# EAGLE design lorelei_B_v1_1 (EAGLE 9.6.2)

## Sheet 1 of 4: Power and decoupling
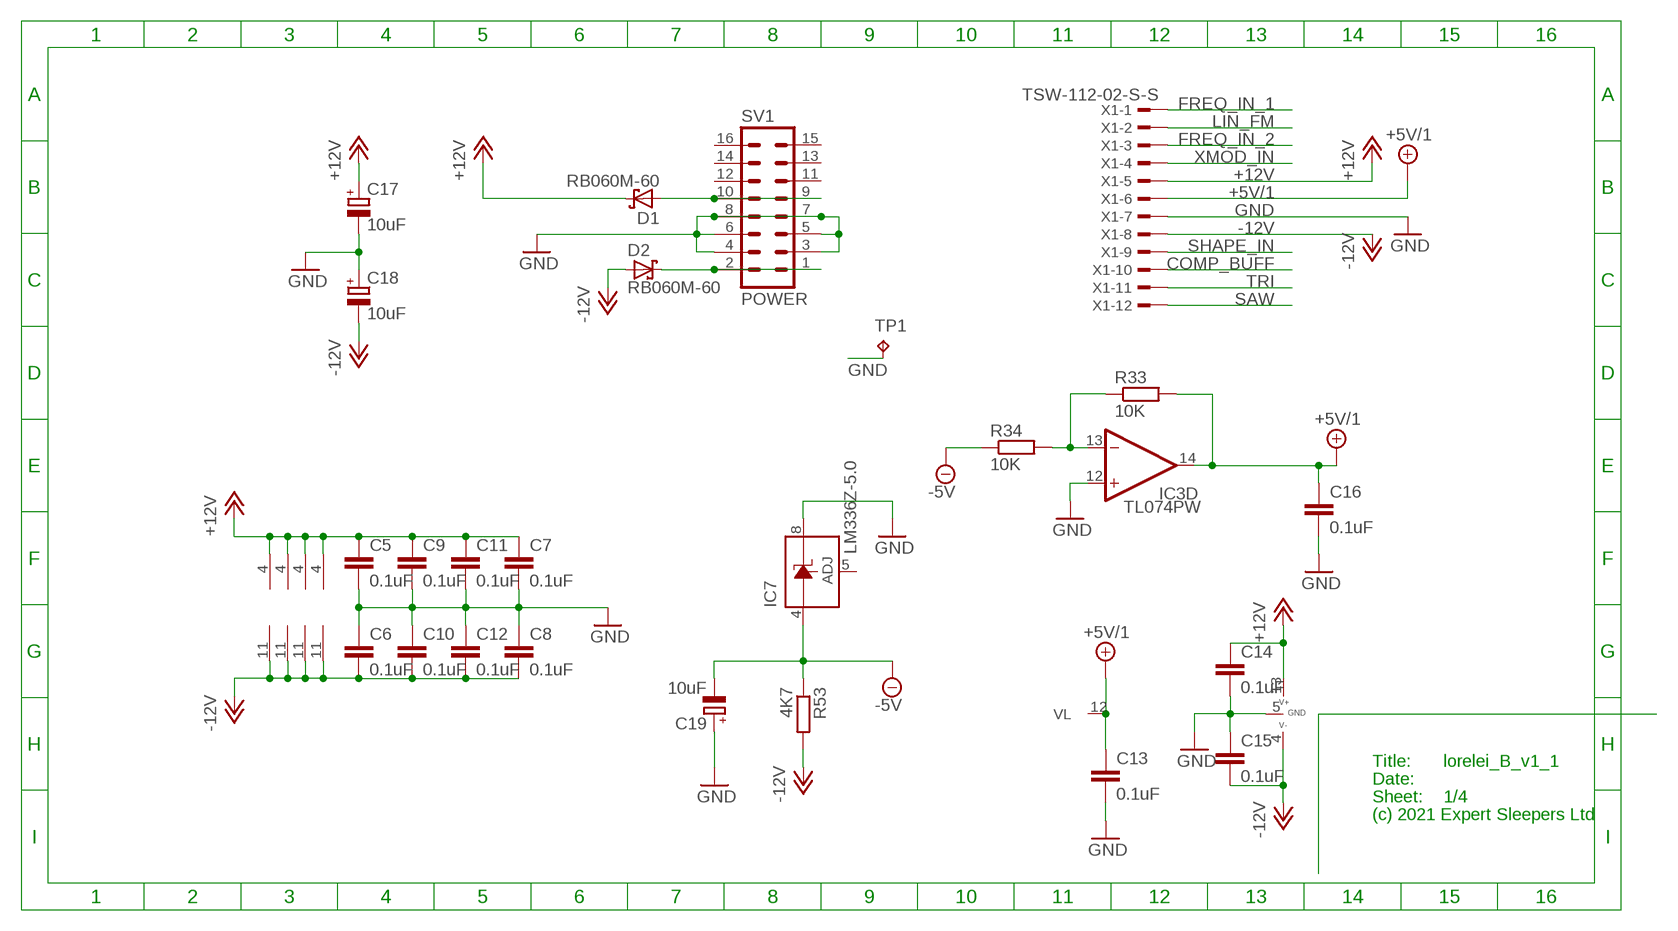
[diagram p0: schematic, sheet 1]

### Parts
C5  0.1uF  C-EUC0402  [C0402]
C6  0.1uF  C-EUC0402  [C0402]
C7  0.1uF  C-EUC0402  [C0402]
C8  0.1uF  C-EUC0402  [C0402]
C9  0.1uF  C-EUC0402  [C0402]
C10  0.1uF  C-EUC0402  [C0402]
C11  0.1uF  C-EUC0402  [C0402]
C12  0.1uF  C-EUC0402  [C0402]
C13  0.1uF  C-EUC0402  [C0402]
C14  0.1uF  C-EUC0402  [C0402]
C15  0.1uF  C-EUC0402  [C0402]
C16  0.1uF  C-EUC0402  [C0402]
C17  10uF  CPOL-EUUD-4X5,8  [UD-4X5,8_NICHICON]
C18  10uF  CPOL-EUUD-4X5,8  [UD-4X5,8_NICHICON]
C19  10uF  CPOL-EUUD-4X5,8  [UD-4X5,8_NICHICON]
D1  RB060M-60  [SOD123FL]
D2  RB060M-60  [SOD123FL]
IC1  TL074PW  [PW_R-PDSO-G14]
IC2  TL074PW  [PW_R-PDSO-G14]
IC3  TL074PW  [PW_R-PDSO-G14]
IC4  TL074PW  [PW_R-PDSO-G14]
IC7  LM336Z-5.0  LM336D  [SO08]
IC8  DG211BDY  DG211CJD  [SO16]
R33  10K  R-EU_R0603  [R0603]
R34  10K  R-EU_R0603  [R0603]
R53  4K7  R-EU_R0603  [R0603]
SV1  POWER  ML16  [ML16]
TP1  RA2  TPPAD1-13  [P1-13]
X1  TSW-112-02-S-S  [TSW-112-02-S-S]

### Nets
+5V/1: C13.1 C16.1 IC3.14(D:OUT) IC8.12(VL:VL) R33.2 X1.6 ; also sheet 4
+12V: C5.1 C7.1 C9.1 C11.1 C14.1 C17.+ D1.C IC1.4(P:V+) IC2.4(P:V+) IC3.4(P:V+) IC4.4(P:V+) IC8.13(P:V+) X1.5 ; also sheet 2,3,4
-5V: C19.- IC7.4(A) R34.1 R53.1 ; also sheet 2
-12V: C6.2 C8.2 C10.2 C12.2 C15.2 C18.- D2.A IC1.11(P:V-) IC2.11(P:V-) IC3.11(P:V-) IC4.11(P:V-) IC8.4(P:V-) R53.2 X1.8 ; also sheet 2,3,4
COMP_BUFF: X1.10 ; also sheet 4
FREQ_IN_1: X1.1 ; also sheet 3
FREQ_IN_2: X1.3 ; also sheet 3
GND [power]: C5.2 C6.1 C7.2 C8.1 C9.2 C10.1 C11.2 C12.1 C13.2 C14.2 C15.1 C16.2 C17.- C18.+ C19.+ IC3.12(D:+IN) IC7.8(C) IC8.5(P:GND) SV1.3 SV1.4 SV1.5 SV1.6 SV1.7 SV1.8 TP1.TP X1.7 ; also sheet 2,3,4
LIN_FM: X1.2 ; also sheet 3
N$1: D2.C SV1.1 SV1.2
N$15: D1.A SV1.9 SV1.10
N$23: IC3.13(D:-IN) R33.1 R34.2
SAW: X1.12 ; also sheet 4
SHAPE_IN: X1.9 ; also sheet 4
TRI: X1.11 ; also sheet 4
XMOD_IN: X1.4 ; also sheet 2
Unconnected: IC7.5(ADJ) SV1.11 SV1.12 SV1.13 SV1.14 SV1.15 SV1.16

### Notes on the sheet
- Title:
- Date:
- Sheet:
- (c) 2021 Expert Sleepers Ltd

## Sheet 2 of 4: VCO core
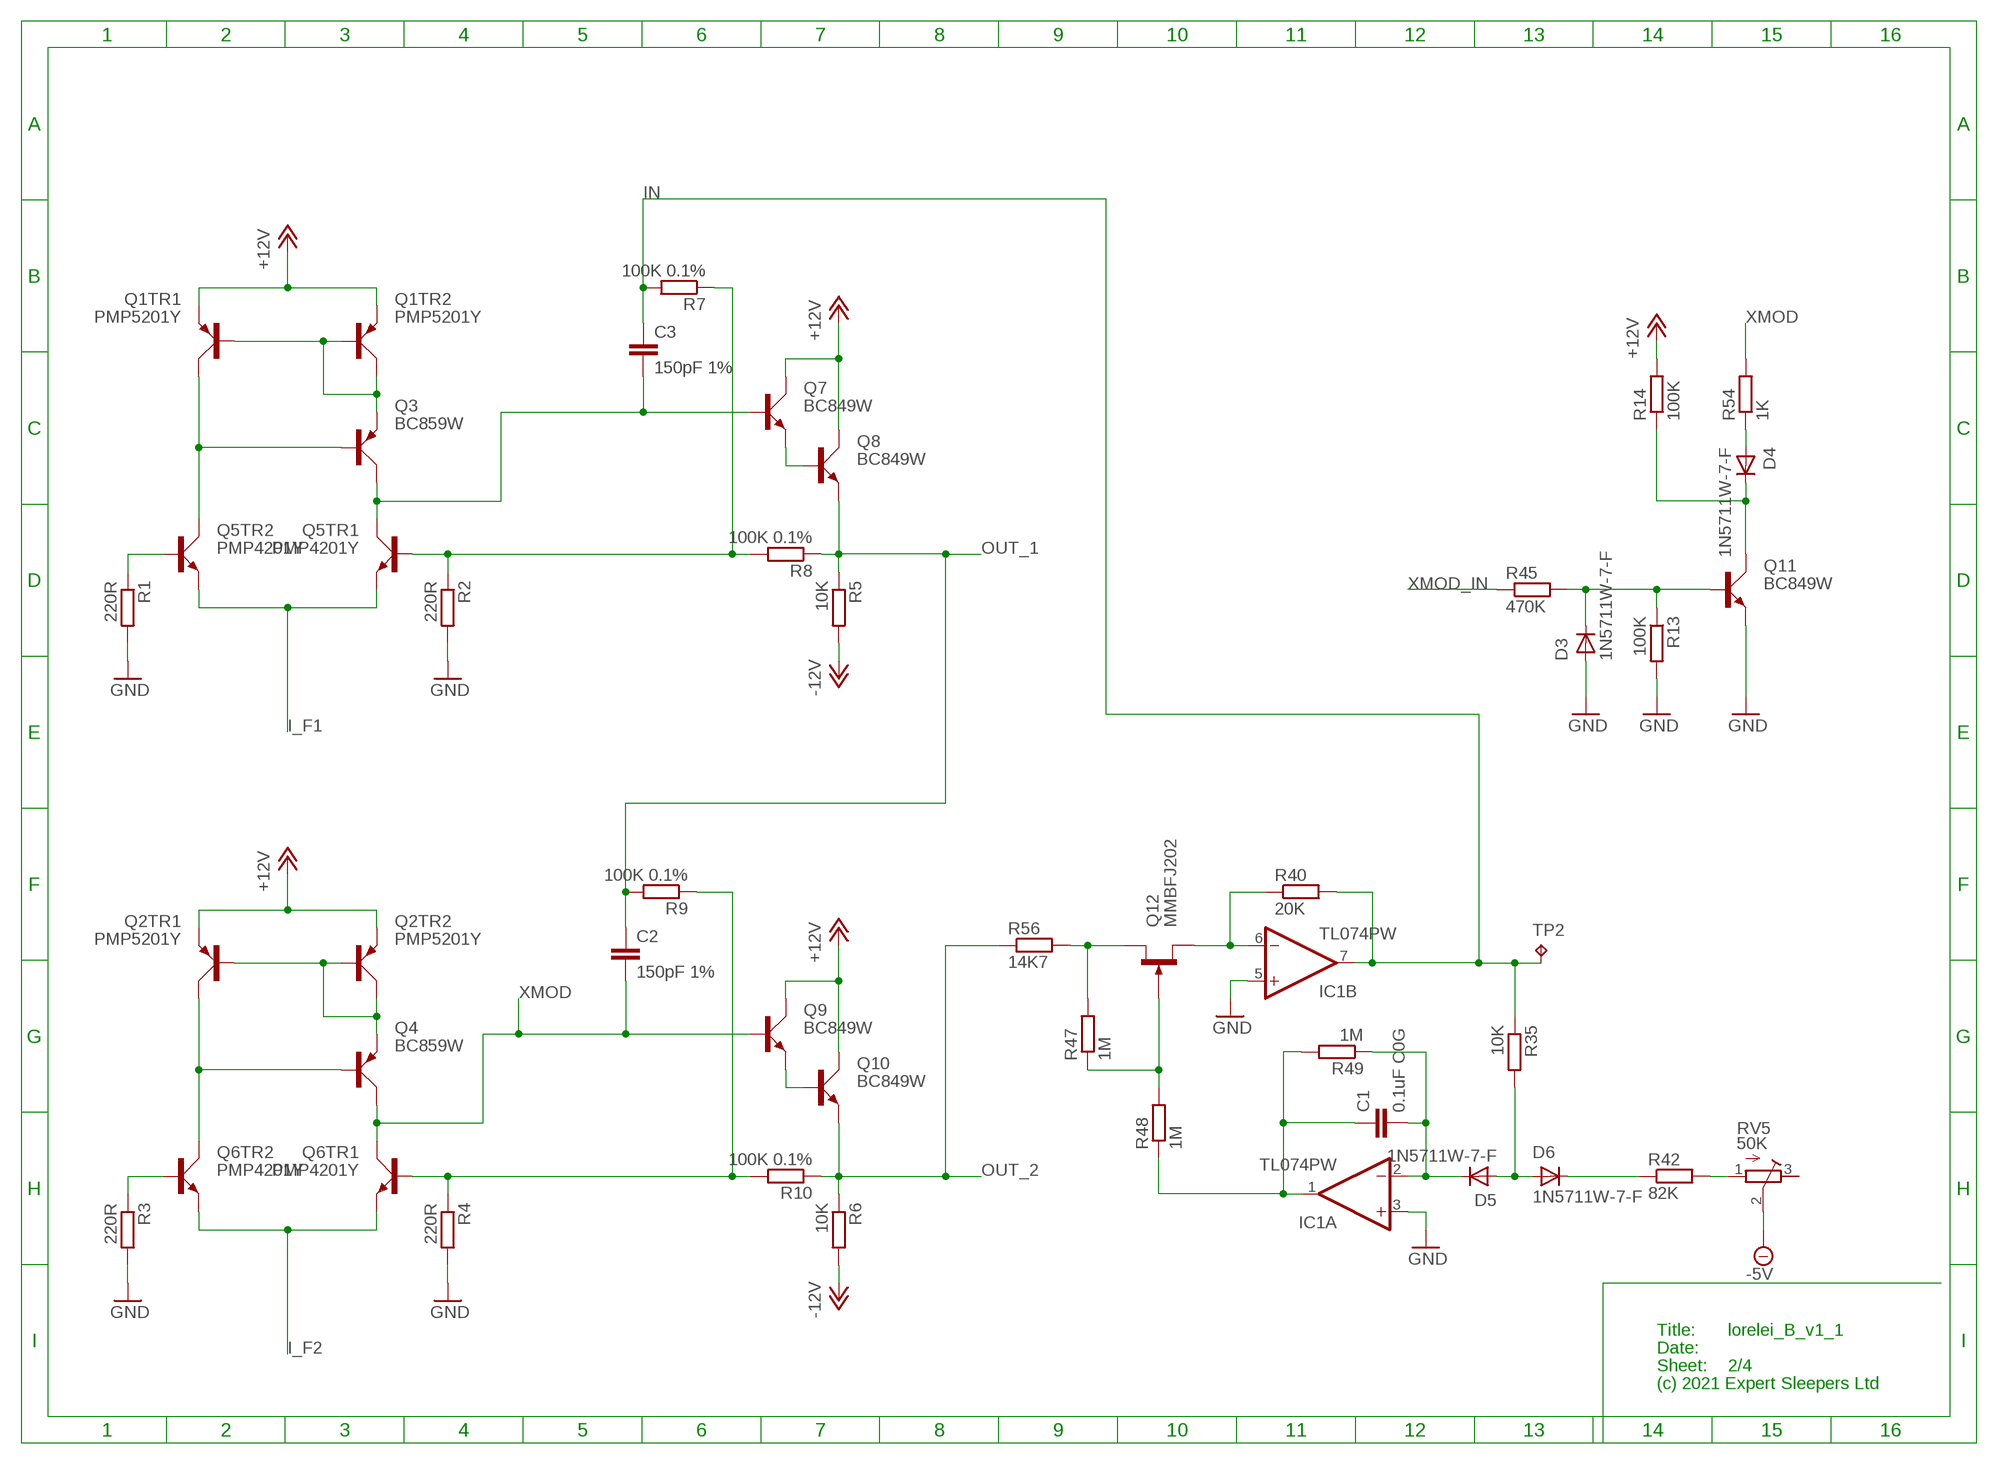
[diagram p1: schematic, sheet 2]

### Parts
C1  0.1uF C0G  C-EUC1206  [C1206]
C2  150pF 1%  C-EUC0805  [C0805]
C3  150pF 1%  C-EUC0805  [C0805]
D3  1N5711W-7-F  1N4148W  [SOD123]
D4  1N5711W-7-F  1N4148W  [SOD123]
D5  1N5711W-7-F  1N4148W  [SOD123]
D6  1N5711W-7-F  1N4148W  [SOD123]
Q1  PMP5201Y  [SOT65P210X110-6N]
Q2  PMP5201Y  [SOT65P210X110-6N]
Q3  BC859W  [SOT323]
Q4  BC859W  [SOT323]
Q5  PMP4201Y  [SOT65P210X110-6N]
Q6  PMP4201Y  [SOT65P210X110-6N]
Q7  BC849W  [SOT323]
Q8  BC849W  [SOT323]
Q9  BC849W  [SOT323]
Q10  BC849W  [SOT323]
Q11  BC849W  [SOT323]
Q12  MMBFJ202  MMBFJ3  [SOT23]
R1  220R  R-EU_R0603  [R0603]
R2  220R  R-EU_R0603  [R0603]
R3  220R  R-EU_R0603  [R0603]
R4  220R  R-EU_R0603  [R0603]
R5  10K  R-EU_R0603  [R0603]
R6  10K  R-EU_R0603  [R0603]
R7  100K 0.1%  R-EU_R0603  [R0603]
R8  100K 0.1%  R-EU_R0603  [R0603]
R9  100K 0.1%  R-EU_R0603  [R0603]
R10  100K 0.1%  R-EU_R0603  [R0603]
R13  100K  R-EU_R0603  [R0603]
R14  100K  R-EU_R0603  [R0603]
R35  10K  R-EU_R0603  [R0603]
R40  20K  R-EU_R0603  [R0603]
R42  82K  R-EU_R0603  [R0603]
R45  470K  R-EU_R0603  [R0603]
R47  1M  R-EU_R0603  [R0603]
R48  1M  R-EU_R0603  [R0603]
R49  1M  R-EU_R0603  [R0603]
R54  1K  R-EU_R0603  [R0603]
R56  14K7  R-EU_R0603  [R0603]
RV5  50K  TC33X  [TC33X]
TP2  RA2  TPPAD1-13  [P1-13]

### Nets
+12V: Q1.4(TR2:E) Q1.5(TR1:E) Q2.4(TR2:E) Q2.5(TR1:E) Q7.3(C) Q8.3(C) Q9.3(C) Q10.3(C) R14.2 ; also sheet 1,3,4
-5V: RV5.2(S) ; also sheet 1
-12V: R5.2 R6.2 ; also sheet 1,3,4
GND [power]: D3.A IC1.3(A:+IN) IC1.5(B:+IN) Q11.2(E) R1.2 R2.2 R3.2 R4.2 R13.2 ; also sheet 1,3,4
I_F1: Q5.4(TR2:E) Q5.5(TR1:E) ; also sheet 3
I_F2: Q6.4(TR2:E) Q6.5(TR1:E) ; also sheet 3
IN: C3.1 IC1.7(B:OUT) R7.2 R35.1 R40.2 TP2.TP ; also sheet 4
JFET_D: Q12.1(D) R47.2 R56.2
JFET_G: Q12.3(G) R47.1 R48.2
JFET_S: IC1.6(B:-IN) Q12.2(S) R40.1
N$6: D3.C Q11.1(B) R13.1 R45.2
N$8: D4.C Q11.3(C) R14.1
N$9: D4.A R54.1
N$12: C1.2 D5.C IC1.2(A:-IN) R49.1
N$26: R42.2 RV5.1(A)
N$53: D5.A D6.A R35.2
N$57: C1.1 IC1.1(A:OUT) R48.1 R49.2
N$59: Q5.2(TR2:B) R1.1
N$64: C3.2 Q3.3(C) Q5.6(TR1:C) Q7.1(B)
N$67: Q5.1(TR1:B) R2.1 R7.1 R8.2
N$68: D6.C R42.1
N$70: Q7.2(E) Q8.1(B)
N$77: Q1.6(TR1:C) Q3.1(B) Q5.3(TR2:C)
N$78: Q1.1(TR1:B) Q1.2(TR2:B) Q1.3(TR2:C) Q3.2(E)
N$79: Q6.2(TR2:B) R3.1
N$83: Q6.1(TR1:B) R4.1 R9.1 R10.2
N$84: Q9.2(E) Q10.1(B)
N$85: Q2.6(TR1:C) Q4.1(B) Q6.3(TR2:C)
N$86: Q2.1(TR1:B) Q2.2(TR2:B) Q2.3(TR2:C) Q4.2(E)
OUT_1: C2.1 Q8.2(E) R5.1 R8.1 R9.2 ; also sheet 4
OUT_2: Q10.2(E) R6.1 R10.1 R56.1
XMOD: C2.2 Q4.3(C) Q6.6(TR1:C) Q9.1(B) R54.2
XMOD_IN: R45.1 ; also sheet 1
Unconnected: RV5.3(E)

### Notes on the sheet
- Title:
- Date:
- Sheet:
- (c) 2021 Expert Sleepers Ltd

## Sheet 3 of 4: Frequency control
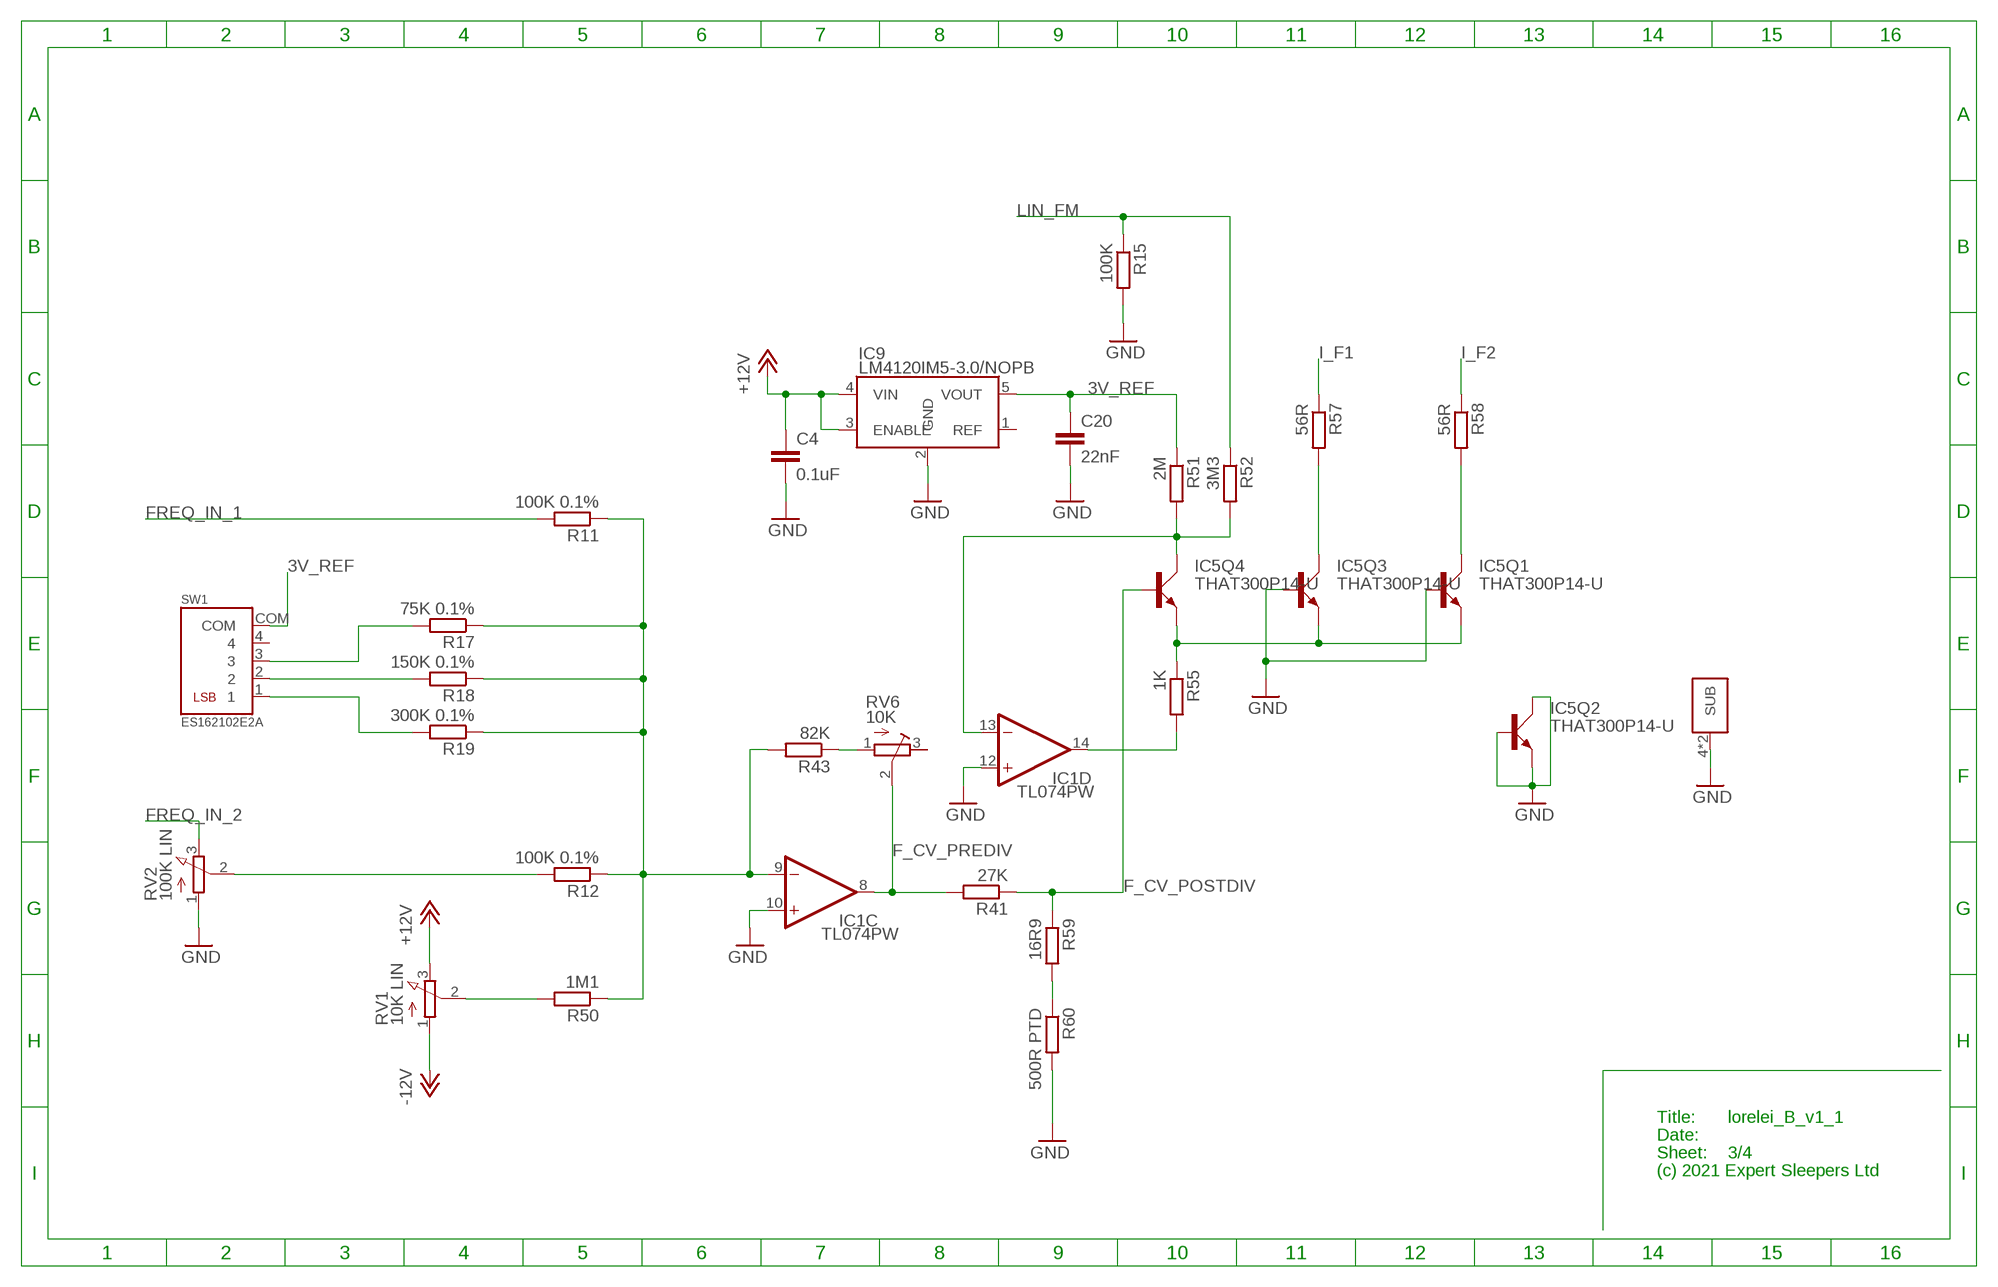
[diagram p2: schematic, sheet 3]

### Parts
C4  0.1uF  C-EUC0402  [C0402]
C20  22nF  C-EUC0402  [C0402]
IC5  THAT300P14-U  [DIL14]
IC9  LM4120IM5-3.0/NOPB  LM4120IM5-5.0_NOPB  [SOT95P280X145-5N]
R11  100K 0.1%  R-EU_R0603  [R0603]
R12  100K 0.1%  R-EU_R0603  [R0603]
R15  100K  R-EU_R0603  [R0603]
R17  75K 0.1%  R-EU_R0603  [R0603]
R18  150K 0.1%  R-EU_R0603  [R0603]
R19  300K 0.1%  R-EU_R0603  [R0603]
R41  27K  R-EU_R0603  [R0603]
R43  82K  R-EU_R0603  [R0603]
R50  1M1  R-EU_R0603  [R0603]
R51  2M  R-EU_R0603  [R0603]
R52  3M3  R-EU_R0603  [R0603]
R55  1K  R-EU_R0603  [R0603]
R57  56R  R-EU_R0603  [R0603]
R58  56R  R-EU_R0603  [R0603]
R59  16R9  R-EU_R0603  [R0603]
R60  500R PTD  R-EU_R0805  [R0805]
RV1  10K LIN  RD1610NOA0X  [RD1610NOA0X]
RV2  100K LIN  RD1610NOA0X  [RD1610NOA0X]
RV6  10K  T93YA  [RTRIM3296W]
SW1  ES162102E2A  [ES162102E2A]

### Nets
3V_REF: C20.1 IC9.5(VOUT) R51.1 SW1.COM
+12V: C4.1 IC9.3(ENABLE) IC9.4(VIN) RV1.3(E) ; also sheet 1,2,4
-12V: RV1.1(A) ; also sheet 1,2,4
F_CV_POSTDIV: IC5.9(Q4:B) R41.1 R59.1
F_CV_PREDIV: IC1.8(C:OUT) R41.2 RV6.2(S)
FREQ_IN_1: R11.2 ; also sheet 1
FREQ_IN_2: RV2.3(E) ; also sheet 1
GND [power]: C4.2 C20.2 IC1.10(C:+IN) IC1.12(D:+IN) IC5.2(Q1:B) IC5.4(SUB) IC5.6(Q3:B) IC5.11(SUB) IC5.12(Q2:E) IC5.13(Q2:B) IC5.14(Q2:C) IC9.2(GND) R15.2 R60.2 RV2.1(A) ; also sheet 1,2,4
I_E_F1: IC5.7(Q3:C) R57.2
I_E_F2: IC5.1(Q1:C) R58.2
I_F1: R57.1 ; also sheet 2
I_F2: R58.1 ; also sheet 2
LIN_FM: R15.1 R52.1 ; also sheet 1
N$2: R19.2 SW1.1
N$4: R43.1 RV6.1(A)
N$13: IC1.9(C:-IN) R11.1 R12.1 R17.1 R18.1 R19.1 R43.2 R50.1
N$14: R18.2 SW1.2
N$16: R17.2 SW1.3
N$36: R12.2 RV2.2(S)
N$37: R50.2 RV1.2(S)
N$38: R59.2 R60.1
N$45: IC5.3(Q1:E) IC5.5(Q3:E) IC5.10(Q4:E) R55.1
N$46: IC1.13(D:-IN) IC5.8(Q4:C) R51.2 R52.2
N$48: IC1.14(D:OUT) R55.2
Unconnected: IC9.1(REF) RV6.3(E) SW1.4

### Notes on the sheet
- Title:
- Date:
- Sheet:
- (c) 2021 Expert Sleepers Ltd

## Sheet 4 of 4: Waveshaping
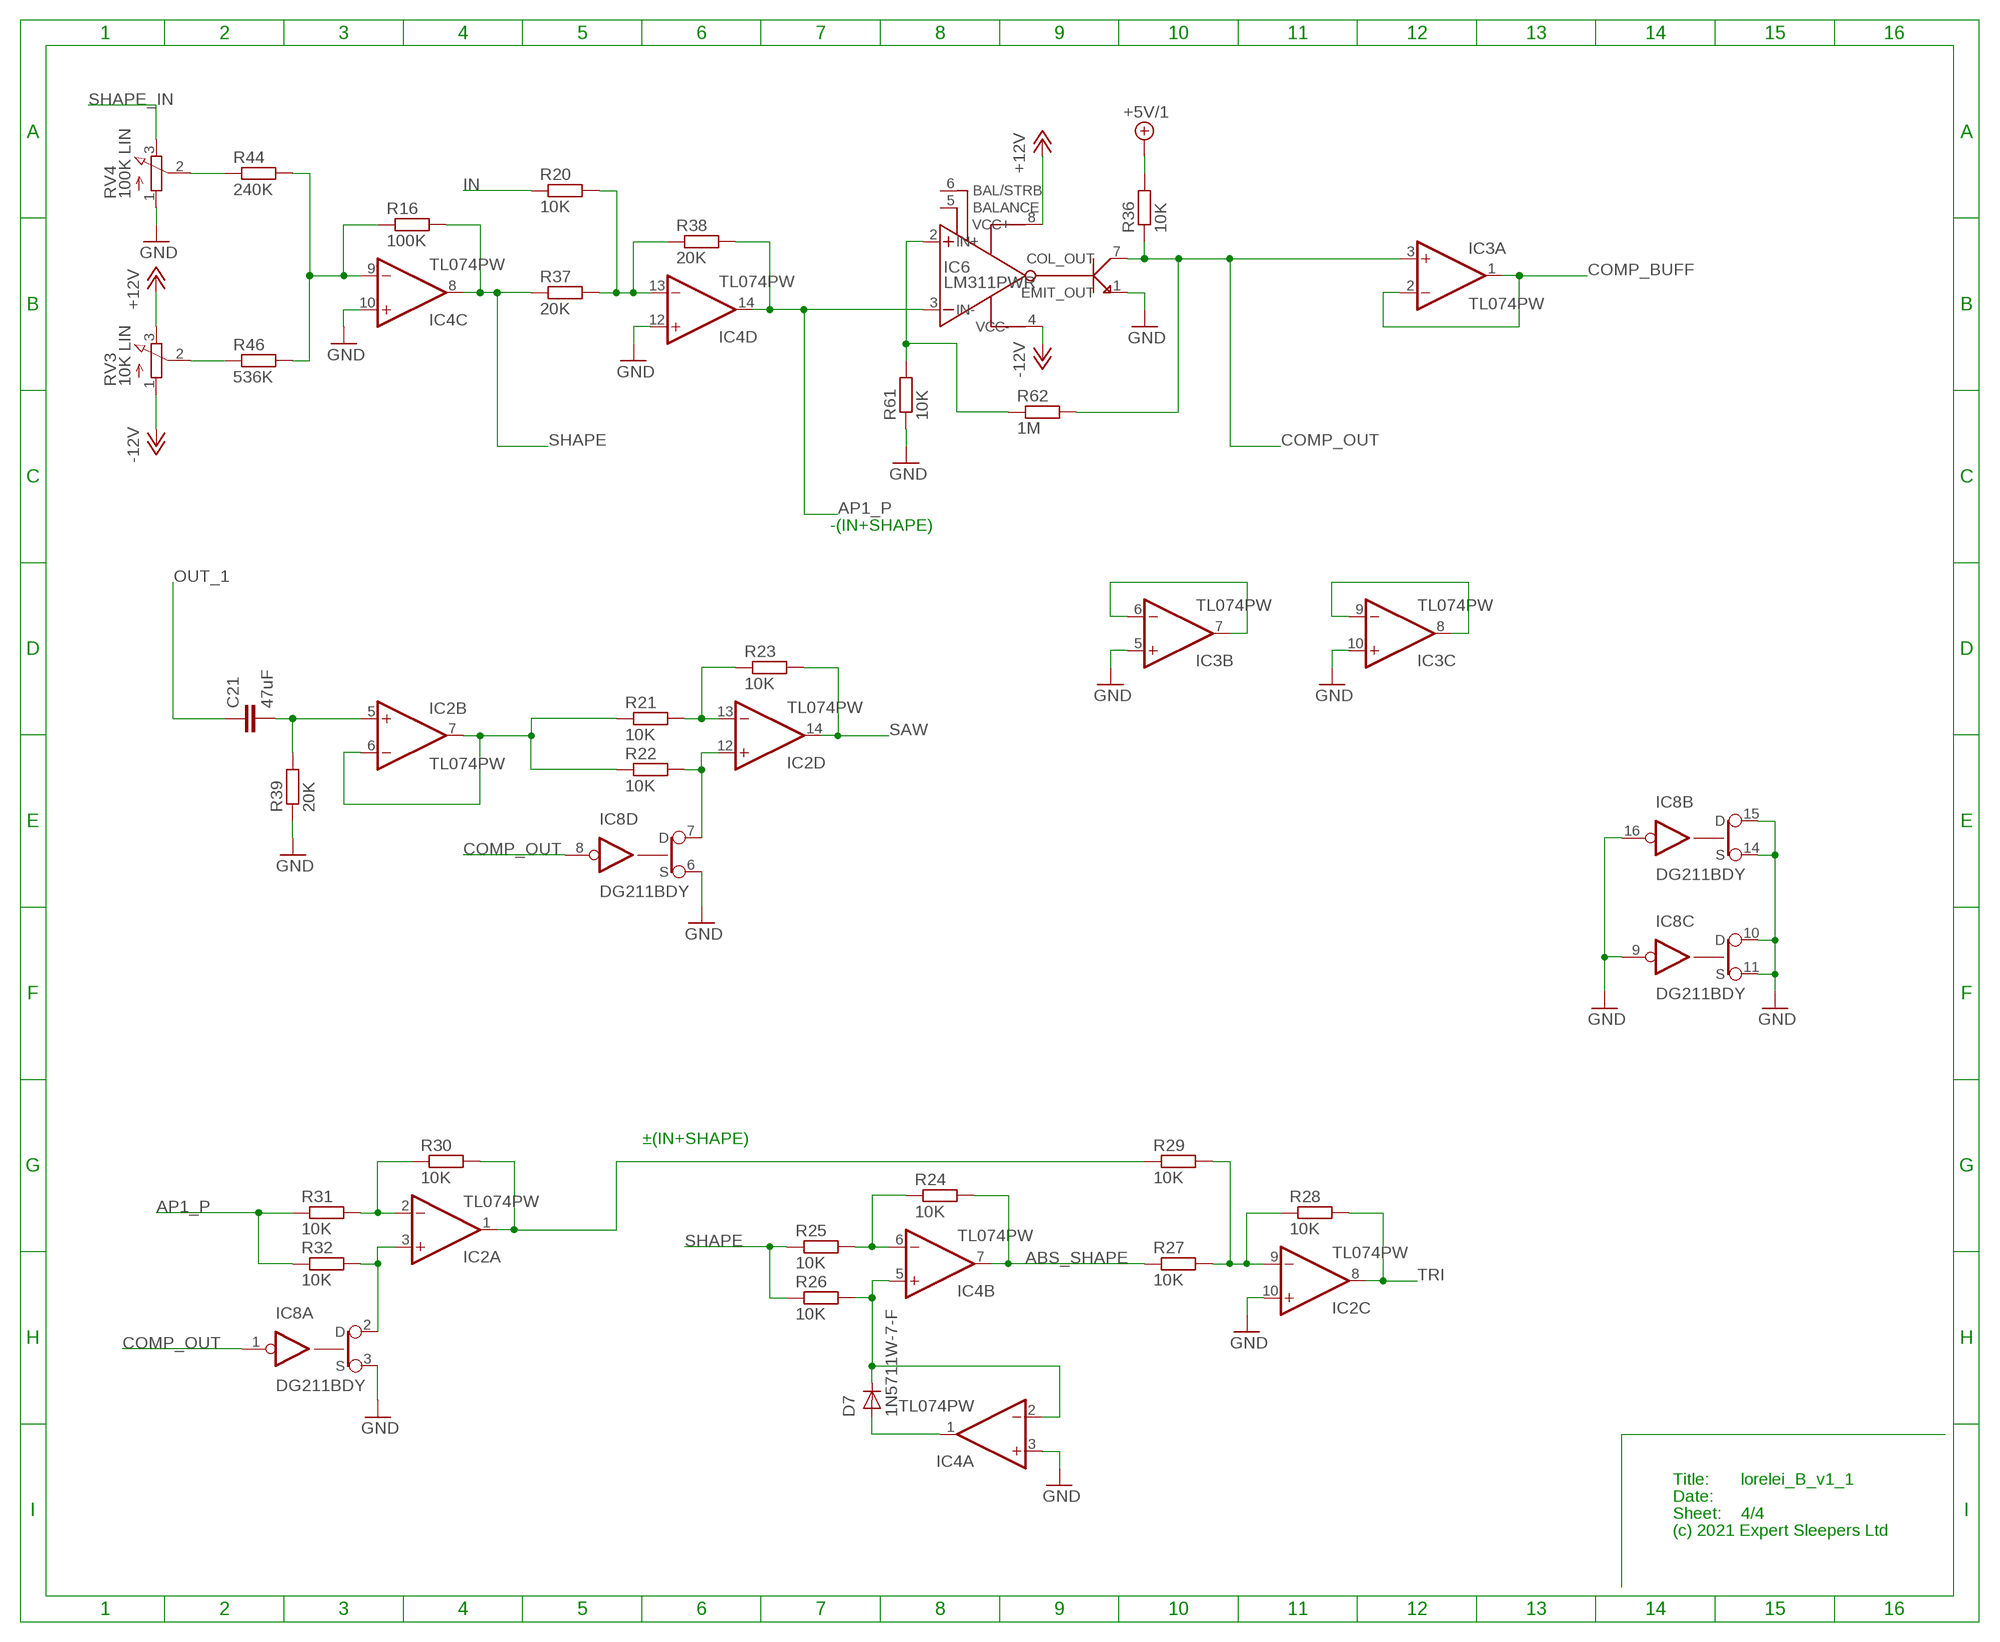
[diagram p3: schematic, sheet 4]

### Parts
C21  47uF  C-EUC1206  [C1206]
D7  1N5711W-7-F  1N4148W  [SOD123]
IC6  LM311PWR  [SOP65P640X120-8N]
R16  100K  R-EU_R0603  [R0603]
R20  10K  R-EU_R0603  [R0603]
R21  10K  R-EU_R0603  [R0603]
R22  10K  R-EU_R0603  [R0603]
R23  10K  R-EU_R0603  [R0603]
R24  10K  R-EU_R0603  [R0603]
R25  10K  R-EU_R0603  [R0603]
R26  10K  R-EU_R0603  [R0603]
R27  10K  R-EU_R0603  [R0603]
R28  10K  R-EU_R0603  [R0603]
R29  10K  R-EU_R0603  [R0603]
R30  10K  R-EU_R0603  [R0603]
R31  10K  R-EU_R0603  [R0603]
R32  10K  R-EU_R0603  [R0603]
R36  10K  R-EU_R0603  [R0603]
R37  20K  R-EU_R0603  [R0603]
R38  20K  R-EU_R0603  [R0603]
R39  20K  R-EU_R0603  [R0603]
R44  240K  R-EU_R0603  [R0603]
R46  536K  R-EU_R0603  [R0603]
R61  10K  R-EU_R0603  [R0603]
R62  1M  R-EU_R0603  [R0603]
RV3  10K LIN  RD1610NOA0X  [RD1610NOA0X]
RV4  100K LIN  RD1610NOA0X  [RD1610NOA0X]

### Nets
+5V/1: R36.2 ; also sheet 1
+12V: IC6.8(VCC+) RV3.3(E) ; also sheet 1,2,3
-12V: IC6.4(VCC-) RV3.1(A) ; also sheet 1,2,3
ABS_SHAPE: IC4.7(B:OUT) R24.2 R27.1
AP1_P: IC4.14(D:OUT) IC6.3(IN-) R31.1 R32.1 R38.2
COMP_BUFF: IC3.1(A:OUT) IC3.2(A:-IN) ; also sheet 1
COMP_OUT: IC3.3(A:+IN) IC6.7(COL_OUT) IC8.1(A:IN) IC8.8(D:IN) R36.1 R62.2
GND [power]: IC2.10(C:+IN) IC3.5(B:+IN) IC3.10(C:+IN) IC4.3(A:+IN) IC4.10(C:+IN) IC4.12(D:+IN) IC6.1(EMIT_OUT) IC8.3(A:S) IC8.6(D:S) IC8.9(C:IN) IC8.10(C:D) IC8.11(C:S) IC8.14(B:S) IC8.15(B:D) IC8.16(B:IN) R39.1 R61.1 RV4.1(A) ; also sheet 1,2,3
IN: R20.1 ; also sheet 2
N$3 [power]: IC6.2(IN+) R61.2 R62.1
N$10: R46.1 RV3.2(S)
N$11: C21.2 IC2.5(B:+IN) R39.2
N$17: IC4.9(C:-IN) R16.1 R44.2 R46.2
N$19: IC4.6(B:-IN) R24.1 R25.2
N$20: IC4.13(D:-IN) R20.2 R37.2 R38.1
N$21: D7.C IC4.2(A:-IN) IC4.5(B:+IN) R26.2
N$30: IC2.6(B:-IN) IC2.7(B:OUT) R21.1 R22.1
N$31: IC2.13(D:-IN) R21.2 R23.1
N$32: IC2.12(D:+IN) IC8.7(D:D) R22.2
N$33: D7.A IC4.1(A:OUT)
N$34: IC2.2(A:-IN) R30.1 R31.2
N$35: IC2.9(C:-IN) R27.2 R28.1 R29.2
N$39: IC2.1(A:OUT) R29.1 R30.2
N$40: IC2.3(A:+IN) IC8.2(A:D) R32.2
N$54: R44.1 RV4.2(S)
N$73: IC3.6(B:-IN) IC3.7(B:OUT)
N$74: IC3.8(C:OUT) IC3.9(C:-IN)
OUT_1: C21.1 ; also sheet 2
SAW: IC2.14(D:OUT) R23.2 ; also sheet 1
SHAPE: IC4.8(C:OUT) R16.2 R25.1 R26.1 R37.1
SHAPE_IN: RV4.3(E) ; also sheet 1
TRI: IC2.8(C:OUT) R28.2 ; also sheet 1
Unconnected: IC6.5(BALANCE) IC6.6(BAL/STRB)

### Notes on the sheet
- -(IN+SHAPE)
- ±(IN+SHAPE)
- Title:
- Date:
- Sheet:
- (c) 2021 Expert Sleepers Ltd

## Library data of the parts
C1-C16 C20 C21 = rcl:C-EU: CAPACITOR, European symbol
C17-C19 = rcl:CPOL-EU: POLARIZED CAPACITOR, European symbol
D1 D2 = rohm2:RB060M-60: Schottky Barrier Diode
D3-D7 = diodes:1N4148W
IC1-IC4 = digital-audio:TL074: OP AMP
IC5 = THAT:THAT300
IC6 = SamacSys_Parts:LM311PWR: High Speed, 30V, Differential Comparator With Strobes Source: Datasheet <http://www.ti.com/lit/ds/symlink/lm311.pdf>; ARROW_PART_NUMBER: LM311PWR; ARROW_PRICE-STOCK: https://www.arrow.com/en/products/lm311pwr/texas-instruments; DESCRIPTION: High Speed, 30V, Differential Comparator With Strobes; HEIGHT: 1.2mm; MANUFACTURER_NAME: Texas Instruments; MANUFACTURER_PART_NUMBER: LM311PWR; MOUSER_PART_NUMBER: 595-LM311PWR; MOUSER_PRICE-STOCK: https://www.mouser.co.uk/ProductDetail/Texas-Instruments/LM311PWR/?qs=YEaxc5757jOQ2Epklu87Vw%3D%3D
IC7 = linear:LM336: 2.5-V INTEGRATED REFERENCE CIRCUITS LM236 Source: http://focus.ti.com/lit/ds/symlink/lm336-2.5.pdf
IC8 = linear:DG211CJ: CMOS SWITCH
IC9 = SamacSys_Parts:LM4120IM5-5.0_NOPB: 0.2% 50ppm/C Drift Precision Series Voltage Reference with Shutdown Enable Source: Datasheet <http://www.ti.com/lit/ds/symlink/lm4120.pdf>; ARROW_PART_NUMBER: LM4120IM5-5.0/NOPB; ARROW_PRICE-STOCK: https://www.arrow.com/en/products/lm4120im5-5.0nopb/texas-instruments; DESCRIPTION: 0.2% 50ppm/C Drift Precision Series Voltage Reference with Shutdown Enable; HEIGHT: 1.45mm; MANUFACTURER_NAME: Texas Instruments; MANUFACTURER_PART_NUMBER: LM4120IM5-5.0/NOPB; MOUSER_PART_NUMBER: 926-LM4120IM550NOPB; MOUSER_PRICE-STOCK: https://www.mouser.co.uk/ProductDetail/Texas-Instruments/LM4120IM5-50-NOPB?qs=QbsRYf82W3GnvXCg2jf3mg%3D%3D
Q1 Q2 = SamacSys_Parts:PMP5201Y: Bipolar Transistors - BJT MATCHED PAIR Source: Datasheet <https://eu.mouser.com/datasheet/2/268/40001414E-1066494.pdf>; ARROW_PART_NUMBER: PMP5201Y,135; ARROW_PRICE-STOCK: https://www.arrow.com/en/products/pmp5201y135/nexperia; DESCRIPTION: Bipolar Transistors - BJT MATCHED PAIR; HEIGHT: 1.1mm; MANUFACTURER_NAME: Nexperia; MANUFACTURER_PART_NUMBER: PMP5201Y,135; MOUSER_PART_NUMBER: 771-PMP5201Y135; MOUSER_PRICE-STOCK: https://www.mouser.co.uk/ProductDetail/Nexperia/PMP5201Y135?qs=LOCUfHb8d9vvvsx1DGNhtA%3D%3D
Q3 Q4 = NXP:BC859W
Q5 Q6 = SamacSys_Parts:PMP4201Y: Bipolar Transistors - BJT MATCHED PAIR Source: Datasheet <https://componentsearchengine.com/Datasheets/1/PMP4201Y,135.pdf>; ARROW_PART_NUMBER: PMP4201Y,135; ARROW_PRICE-STOCK: https://www.arrow.com/en/products/pmp4201y135/nexperia; DESCRIPTION: Bipolar Transistors - BJT MATCHED PAIR; HEIGHT: 1.1mm; MANUFACTURER_NAME: Nexperia; MANUFACTURER_PART_NUMBER: PMP4201Y,135; MOUSER_PART_NUMBER: 771-PMP4201Y135; MOUSER_PRICE-STOCK: https://www.mouser.co.uk/ProductDetail/Nexperia/PMP4201Y135?qs=LOCUfHb8d9uqwNS3d98RHQ%3D%3D
Q7-Q11 = NXP:BC849W
Q12 = transistor-small-signal:MMBFJ3*: N-Channel RF Amplifier Source: http://www.fairchildsemi.com/pf/J3/J310.html
R1-R62 = rcl:R-EU_: RESISTOR, European symbol
RV1-RV4 = soundwell:RD1610NOA0X: 16mm Potentiometer one level Source: http://www.alphapotentiometers.net/html/16mm_pot_2.html
RV5 = bourns:TC33X
RV6 = vishay:T93YA
SV1 = digital-audio:ML16: MULTICOMP - MC9A12-1634
SW1 = soundwell:ES162102E2A
TP1 TP2 = testpad:TP: Test pad
X1 = con-samtec:TSW-112-02-S-S: THROUGH-HOLE .025" SQ POST HEADER Source: Samtec TSW.pdf; OC_FARNELL: unknown; OC_NEWARK: unknown

## Board
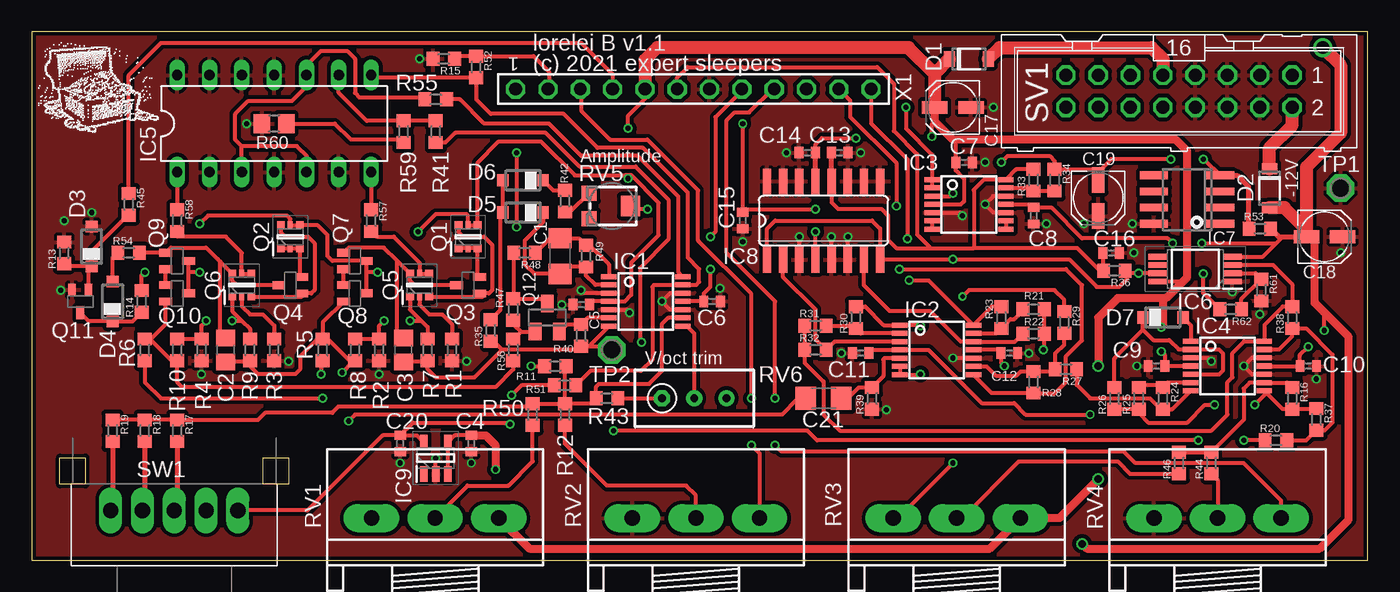
[diagram p4: board, top side]
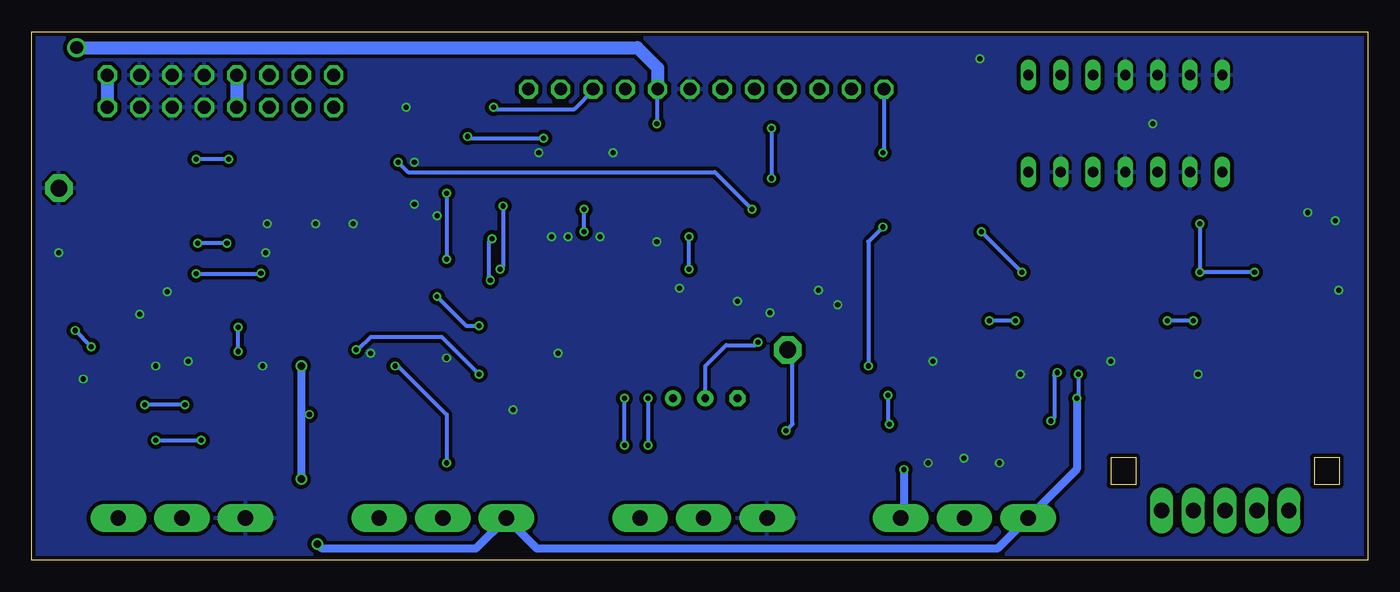
[diagram p5: board, bottom side, seen from below]

Size 105 x 41.5 mm. Coordinates in mm from the lower left corner, seen from the top.
Outline: 0,0 105,0 105,41.5 0,41.5 0,0
Copper layers (1*16): Top 0.035mm / dielectric 1.5mm / Bottom 0.035mm
Design rules "pcbtrain *": minimum track width 0.125mm, minimum drill 0.3mm, track to track 0.125mm, track to pad 0.125mm, pad to pad 0.125mm, via to via 0.125mm, smd to smd 0.125mm, copper to edge 0.25mm, drill to drill 8mil, minimum pad ring 0.15mm, minimum via ring 0.15mm, stop-mask expansion 4mil, vias tented up to drill 0mil, thermal gap 10mil

### Footprints (pad centres in the part's own frame; a part is rotated, then mirrored left to right if it is on the bottom)
C1206 = smd 1.6 x 1.8: 1 -1.4,0; 2 1.4,0
C0805 = smd 1.3 x 1.5: 1 -0.95,0; 2 0.95,0
C0402 = smd 0.7 x 0.9: 1 -0.65,0; 2 0.65,0
UD-4X5,8_NICHICON = smd 2 x 1: + 1.425,0; - -1.425,0
SOD123FL = smd 0.85 x 1.2: A 1.525,0; C -1.525,0
SOD123 = smd 0.9 x 0.95: A 1.575,0; C -1.575,0
PW_R-PDSO-G14 = smd 0.4 x 1.2: 1 -1.95,-2.9; 2 -1.3,-2.9; 3 -0.65,-2.9; 4 0,-2.9; 5 0.65,-2.9; 6 1.3,-2.9; 7 1.95,-2.9; 8 1.95,2.9; 9 1.3,2.9; 10 0.65,2.9; 11 0,2.9; 12 -0.65,2.9; 13 -1.3,2.9; 14 -1.95,2.9
DIL14 = drill 0.813 long: 1 -7.62,-3.81; 2 -5.08,-3.81; 3 -2.54,-3.81; 4 0,-3.81; 5 2.54,-3.81; 6 5.08,-3.81; 7 7.62,-3.81; 8 7.62,3.81; 9 5.08,3.81; 10 2.54,3.81; 11 0,3.81; 12 -2.54,3.81; 13 -5.08,3.81; 14 -7.62,3.81
SOP65P640X120-8N = smd 1.475 x 0.45: 1 -2.938,0.975; 2 -2.938,0.325; 3 -2.938,-0.325; 4 -2.938,-0.975; 5 2.938,-0.975; 6 2.938,-0.325; 7 2.938,0.325; 8 2.938,0.975
SO08 = smd 0.6 x 2.2: 1 -1.905,-2.6; 2 -0.635,-2.6; 3 0.635,-2.6; 4 1.905,-2.6; 5 1.905,2.6; 6 0.635,2.6; 7 -0.635,2.6; 8 -1.905,2.6
SO16 = smd 0.66 x 2.032: 1 -4.445,-3.073; 2 -3.175,-3.073; 3 -1.905,-3.073; 4 -0.635,-3.073; 5 0.635,-3.073; 6 1.905,-3.073; 7 3.175,-3.073; 8 4.445,-3.073; 9 4.445,3.073; 10 3.175,3.073; 11 1.905,3.073; 12 0.635,3.073; 13 -0.635,3.073; 14 -1.905,3.073; 15 -3.175,3.073; 16 -4.445,3.073
SOT95P280X145-5N = smd 1.2 x 0.6: 1 -1.25,0.95; 2 -1.25,0; 3 -1.25,-0.95; 4 1.25,-0.95; 5 1.25,0.95
SOT65P210X110-6N = smd 0.6 x 0.6: 1 -0.9,0.75; 3 -0.9,-0.75; 4 0.9,-0.75; 6 0.9,0.75 | smd 0.6 x 0.4: 2 -0.9,0; 5 0.9,0
SOT323 = smd 0.6 x 1: 1 -0.65,-0.9; 2 0.65,-0.9; 3 0,0.9
SOT23 = smd 1 x 1.4: 1 -0.95,-1.1; 2 0.95,-1.1; 3 0,1.1
R0603 = smd 1 x 1.1: 1 -0.85,0; 2 0.85,0
R0805 = smd 1.3 x 1.5: 1 -0.95,0; 2 0.95,0
RD1610NOA0X = drill 1.2 pad 2.184 long: 1 -5,3.8; 2 0,3.8; 3 5,3.8
TC33X = smd 1.2 x 1.2: 1 -1,-1.8; 3 1,-1.8 | smd 1.6 x 1.5: 2 0,1.45
RTRIM3296W = drill 0.61 pad 1.27 octagon: 1 0,-2.54 | drill 0.61 pad 1.27: 2 0,0; 3 0,2.54
ML16 = drill 1.016 octagon: 1 -8.89,-1.27; 2 -8.89,1.27; 3 -6.35,-1.27; 4 -6.35,1.27; 5 -3.81,-1.27; 6 -3.81,1.27; 7 -1.27,-1.27; 8 -1.27,1.27; 9 1.27,-1.27; 10 1.27,1.27; 11 3.81,-1.27; 12 3.81,1.27; 13 6.35,-1.27; 14 6.35,1.27; 15 8.89,-1.27; 16 8.89,1.27
ES162102E2A = drill 1.2 long: 1 -5,4.4; 2 -2.5,4.4; 3 0,4.4; 4 2.5,4.4; COM 5,4.4
P1-13 = drill 1.321 pad 2.159 octagon: TP 0,0
TSW-112-02-S-S = drill 1 pad 1.5 octagon: 1 13.97,0; 2 11.43,0; 3 8.89,0; 4 6.35,0; 5 3.81,0; 6 1.27,0; 7 -1.27,0; 8 -3.81,0; 9 -6.35,0; 10 -8.89,0; 11 -11.43,0; 12 -13.97,0

### Placement (x,y rotation side)
C1  41.53,23.88 270 top
C2  15.24,16.51 90 top
C3  29.21,16.51 90 top
C4  34.54,9.14 270 top
C5  43.18,20.07 180 top
C6  53.47,20.32 180 top
C7  73.28,31.24 0 top
C8  78.74,27.05 90 top
C9  88.39,15.24 180 top
C10  100.33,15.24 180 top
C11  65.15,16.26 180 top
C12  76.83,16.26 180 top
C13  63.5,32 0 top
C14  60.96,32 180 top
C15  55.88,26.67 90 top
C16  84.84,24.13 0 top
C17  72.39,35.56 180 top
C18  101.6,25.4 0 top
C19  83.82,28.45 270 top
C20  28.96,9.14 270 top
C21  62.23,12.7 0 top
D1  73.66,39.37 0 top
D2  97.28,29.21 270 top
D3  4.7,24.64 90 top
D4  6.35,20.32 90 top
D5  38.61,27.3 180 top
D6  38.61,29.84 180 top
D7  88.9,19.05 0 top
IC1  48.26,20.32 270 top
IC2  71.12,16.51 270 top
IC3  73.66,27.94 270 top
IC4  93.98,15.24 270 top
IC5  19.05,34.29 0 top
IC6  91.44,22.86 180 top
IC7  90.81,28.32 90 top
IC8  62.23,26.67 0 top
IC9  31.75,8 90 top
Q1  34.29,25.4 90 top
Q2  20.32,25.4 90 top
Q3  34.29,21.59 90 top
Q4  20.32,21.59 90 top
Q5  30.48,21.59 90 top
Q6  16.51,21.59 90 top
Q7  25.4,23.5 270 top
Q8  25.4,20.95 270 top
Q9  11.43,23.5 270 top
Q10  11.43,20.95 270 top
Q11  3.81,20.32 180 top
Q12  40.51,19.05 0 top
R1  33.02,16.51 270 top
R2  27.3,16.51 270 top
R3  19.05,16.51 270 top
R4  13.34,16.51 270 top
R5  22.86,16.51 270 top
R6  8.89,16.51 270 top
R7  31.11,16.51 270 top
R8  25.4,16.51 90 top
R9  17.14,16.51 270 top
R10  11.43,16.51 90 top
R11  41.15,15.24 180 top
R12  41.91,11.43 270 top
R13  2.54,24.13 90 top
R14  8.64,20.32 90 top
R15  32.38,39.37 180 top
R16  99.06,12.7 270 top
R17  11.43,10.16 270 top
R18  8.89,10.16 270 top
R19  6.35,10.16 270 top
R20  97.79,9.4 0 top
R21  78.74,19.68 180 top
R22  78.74,17.78 180 top
R23  76.2,19.05 90 top
R24  88.9,12.7 270 top
R25  87,12.7 90 top
R26  85.09,12.7 90 top
R27  81.28,14.99 180 top
R28  78.74,13.97 270 top
R29  81.15,18.67 270 top
R30  64.77,19.05 90 top
R31  61.59,18.41 0 top
R32  61.59,16.51 0 top
R33  78.74,29.84 90 top
R34  80.39,29.84 270 top
R35  36.07,18.03 90 top
R36  85.09,22.73 180 top
R37  100.97,11.05 270 top
R38  99.06,19.05 90 top
R39  66.04,12.7 90 top
R40  43.18,17.65 270 top
R41  31.75,33.66 270 top
R42  41.91,28.19 270 top
R43  45.21,12.7 180 top
R44  92.71,7.62 90 top
R45  7.62,27.94 270 top
R46  90.17,7.62 90 top
R47  37.85,19.68 270 top
R48  38.73,24.13 180 top
R49  43.56,23.88 90 top
R50  39.37,11.43 270 top
R51  41.91,13.72 0 top
R52  34.92,38.73 270 top
R53  96.52,26.04 0 top
R54  7.62,24.13 0 top
R55  31.75,36.2 0 top
R56  37.85,16.51 90 top
R57  26.67,26.67 90 top
R58  11.43,26.67 90 top
R59  29.21,33.66 270 top
R60  19.05,34.29 180 top
R61  96.65,21.21 90 top
R62  94.23,19.68 180 top
RV1  31.7,-0.5 0 top
RV2  52.2,-0.5 0 top
RV3  72.7,-0.5 0 top
RV4  93.2,-0.5 0 top
RV5  45.59,27.81 270 top
RV6  52.07,12.7 270 top
SV1  90.17,36.83 180 top
SW1  11.2,-0.5 0 top
TP1  102.87,29.21 0 top
TP2  45.59,16.51 0 top
U$3  [TREASURE_10MM_300DPI]  0.13,33.53 0 top
X1  52,37 180 top

### Tracks (layer width: path | path; a pad name or v marks a point on that pad's centre or on a via)
3V_REF  (via drill 0.4)
  Top 0.305: SW1.COM 21.68,3.9 27.57,9.79 C20.1 | C20.1 30.26,9.79 IC9.5 | C20.1 29.96,10.79 37.47,10.79 v37.59,10.67 | R51.1 38.48,13.72 v37.72,12.95
  Bottom 0.305: v37.59,10.67 37.72,10.79 v37.72,12.95
+5V/1
  Top 0.305: 70.66,24.51 74.04,24.51 | IC8.12 62.87,28.09 63.4,27.56 66.8,27.56 67.31,27.05 67.31,25.15 67.94,24.51 70.66,24.51 | X1.6 50.73,37.9 51.56,38.73 55.88,38.73 66.45,38.73 67.76,37.43 67.76,33.71 69.58,31.9 69.58,25.59 70.66,24.51 | 74.04,24.51 82.17,24.51 83.95,22.73 R36.2 84.19,22.79 C16.1 | R33.2 77.36,30.7 IC3.14 74.85,29.89 74.04,29.08 74.04,24.51
  Top 0.406: IC8.12 C13.1
+12V  (via drill 0.4, 0.6)
  Top 0.305: Q8.3 26.3,22.61 | 26.3,22.61 Q7.3 23.62,23.5 23.24,23.88 23.24,25.53 22.47,26.3 Q2.4 Q2.5 20.32,26.8 20.07,27.05 13.84,27.05 v13.21,26.42 | Q10.3 12.33,22.61 | 12.33,22.61 Q9.3 | v13.21,22.61 12.33,22.61 | v30.35,25.78 31.75,27.18 34.16,27.18 34.29,27.05 Q1.5 Q1.4 35.04,31.23 36.7,32.89 40.01,32.89 42.68,30.22 46.62,30.22 | v27.18,22.61 26.3,22.61 | R14.2 8.64,22.35 v8.89,22.61 | C5.1 44.08,20.32 IC1.4 46.61,20.32 47.12,20.83 47.12,23.37 49.28,25.53 49.28,28.07 47.13,30.22 46.62,30.22 | C11.1 66.06,16.51 IC2.4 70.48,16.51 74.68,12.32 77.22,12.32 78.11,11.43 v83.19,11.43 | IC4.4 C9.1 89.04,16.11 v88.77,16.38 | IC9.3 IC9.4 33.24,9.79 C4.1 | C14.1 61.61,32.65 62.1,33.15 v64.77,33.15 | v70.74,33.27 70.74,34.22 70.97,34.45 | v46.86,33.91 46.86,34.92 48.26,36.32 48.26,36.93 X1.5 | 46.62,30.22 v46.86,29.97 | IC3.4 73.03,27.94 73.26,28.18 73.26,29.97 72.63,30.61 C7.1 72.63,32.78 72.39,33.02 | 90.81,22.23 90.47,21.89 IC6.8
  Top 0.406: IC8.13 C14.1
  Top 0.61: C17.+ 70.97,34.45 72.39,33.02 89.92,33.02 90.81,32.13 90.81,22.23 89.15,20.57 88.9,20.57 | RV1.3 39.11,0.89 75.29,0.89 RV3.3 80.77,3.3 v83.82,6.35 | 88.9,20.57 85.34,20.57 83.82,19.05 v83.82,15.24 | 88.9,20.57 88.9,18.41 v88.77,18.29 | C4.1 35.67,9.79 36.45,9.02 v36.45,7.11
  Top 1.016: D1.C 70.97,38.2 | C17.+ 70.97,38.2 | 70.97,38.2 68.91,40.26 49.15,40.26 48.19,39.3 X1.5
  Bottom 0.305: v13.21,26.42 v13.21,22.61 v8.89,22.61 | v30.35,25.78 v27.18,22.61 | v88.77,16.38 v88.77,18.29 | v70.74,33.27 70.61,33.15 v64.77,33.15 | v83.19,11.43 83.82,11.43 | v46.86,33.91 v46.86,29.97
  Bottom 0.61: v83.82,15.24 83.82,11.43 v83.82,6.35 | v36.45,7.11 36.45,3.55 RV1.3
-5V  (via drill 0.4)
  Top 0.305: v92.08,31.5 92.14,31.5 IC7.4 | 83.82,30.48 83.61,30.7 R34.1 80.39,31.37 80.01,31.75 76.71,31.75 v76.2,31.24 | 83.82,30.48 C19.- | 83.82,30.48 84.84,31.5 v89.53,31.5 | RV5.2 47.3,27.56 v48.39,27.56
  Top 0.406: IC7.4 94.74,30.23 95.63,29.34 95.63,26.07 R53.1
  Bottom 0.305: v89.53,31.5 v92.08,31.5 | v48.39,27.56 51.31,30.48 75.44,30.48 v76.2,31.24
-12V  (via drill 0.4, 0.6, 1)
  Top 0.305: IC1.11 C6.2 52.82,20.94 53.34,21.46 v53.34,22.86 | IC2.11 75.93,16.51 C12.2 76.19,15.51 v76.45,15.24 | IC4.11 C10.2 99.68,16.11 v100.33,16.76 | IC8.4 v61.59,25.78 | v61.59,27.56 56.12,27.56 C15.2 v55.88,34.29 | IC6.4 96.77,23.84 97.82,24.89 | 97.82,24.89 98.33,25.4 C18.- 100.84,24.74 | R5.2 22.73,15.53 v22.73,14.61 | R6.2 8.89,13.97 10.16,12.7 v22.86,12.7 | X1.8 55.81,36.89 53.72,34.8 53.72,25.78 v53.34,25.4 | IC3.11 78.5,27.94 C8.2 80.12,27.7 82.55,25.27 89.28,25.27 v89.66,24.89 | v91.95,24.89 97.82,24.89 | v101.6,18.03 101.6,19.43 101.54,19.49 | v72.39,7.62 68.07,3.3 RV3.1
  Top 0.406: R53.2 98,25.4 C18.-
  Top 0.61: 100.84,24.74 100.84,20.19 101.54,19.49 103.5,17.53 103.5,3.17 101.22,0.89 82.93,0.89 v82.55,1.27
  Top 1.016: D2.A 98.45,27.68 100.17,25.96 C18.- 100.17,30.86 102.87,33.56 102.87,38.86 v101.47,40.26
  Bottom 0.305: v61.59,25.78 v61.59,27.56 | v22.73,14.61 22.73,12.83 v22.86,12.7 | v55.88,34.29 55.81,34.36 X1.8 | v89.66,24.89 v91.95,24.89 | v53.34,22.86 v53.34,25.4 | v72.39,7.62 72.39,11.43 76.2,15.24 v76.45,15.24 | v100.33,16.76 v101.6,18.03
  Bottom 0.61: v22.86,12.7 22.86,7.14 RV1.1 29.11,0.89 65.29,0.89 RV3.1 70.11,0.89 82.17,0.89 v82.55,1.27
  Bottom 1.016: X1.8 55.81,38.66 57.4,40.26 v101.47,40.26
ABS_SHAPE
  Top 0.305: IC4.7 89.64,11.85 R24.2 88.73,11.85 87.88,12.7 83.19,12.7 82.13,13.76 R27.1
AP1_P
  Top 0.305: R31.1 R32.1 60.74,15.49 62.23,14.01 62.23,11.43 63.5,10.16 92.71,10.16 93.98,11.43 93.98,13.97 94.36,14.35 94.36,16.26 95.3,17.19 IC4.14 96.88,18.46 98.32,19.9 R38.2 99.06,21.68 97.55,23.18 IC6.3
COMP_BUFF  (via drill 0.4)
  Top 0.305: v68.71,35.56 68.71,33.91 70.76,31.86 IC3.1 IC3.2
  Bottom 0.305: X1.10 60.89,36.9 62.36,35.43 68.58,35.43 v68.71,35.56
COMP_OUT  (via drill 0.4)
  Top 0.305: IC6.7 v87,22.54 86.14,22.54 86.09,22.59 | 86.09,22.59 R36.1 | IC8.1 57.78,26.04 58.42,26.67 66.04,26.67 66.67,26.04 IC8.8 66.7,23.62 v72.39,23.62 81.53,23.62 83.69,21.46 85.47,21.46 86.09,22.08 86.09,22.59 | IC3.3 72.15,28.59 v72.39,28.83 | R62.2 92.08,20.99 v92.08,22.48
  Bottom 0.305: v72.39,28.83 v72.39,23.62 | v92.08,22.48 87.05,22.48 v87,22.54
F_CV_POSTDIV
  Top 0.305: IC5.9 24.13,36.7 26.33,34.51 R59.1 R41.1
F_CV_PREDIV  (via drill 0.4)
  Top 0.305: R41.2 32.51,32.8 33.27,33.57 40.39,33.57 43.05,30.9 47.46,30.9 50.04,28.32 50.04,25.18 47.8,22.94 47.8,17.23 v47.92,17.1 | RV6.2 52.07,17.78 51.48,18.37 IC1.8
  Bottom 0.305: v47.92,17.1 48.13,16.89 50.42,16.89 52.07,15.24 RV6.2
FREQ_IN_1  (via drill 0.4)
  Top 0.305: v38.1,32 v38.1,26.16 | v39.24,15.24 R11.2
  Bottom 0.305: v38.1,32 38.03,32.07 X1.1 | v38.1,26.16 39.24,25.02 v39.24,15.24
FREQ_IN_2  (via drill 0.4)
  Top 0.305: X1.3 43.18,36.93 43.18,35.31 45.47,33.02 48.39,33.02 52.37,29.03 52.37,25.1 56.56,20.91 v56.56,12.7 | v56.56,9.02 57.2,8.38 RV2.3
  Bottom 0.305: v56.56,12.7 v56.56,9.02
GND  (via drill 0.4)
  Top 0.305: IC9.2 v31.75,8 | IC1.12 50.18,20.97 v49.53,20.32 50.18,19.67 IC1.10 | v72.39,15.88 74,15.88 IC2.10 | IC8.6 v64.14,25.4 | IC8.5 v62.87,25.4 | IC8.3 v60.33,25.4 | IC4.3 92.44,15.89 v92.71,15.62 | IC4.12 95.9,15.89 v95.25,15.24 95.9,14.59 IC4.10 | IC1.3 43.42,20.97 v43.18,21.21 | IC1.5 46.75,19.67 v46.99,19.43 | IC3.12 75.58,28.59 v74.93,27.94 75.58,27.29 IC3.10 | IC3.5 72.91,27.29 v73.15,27.05
  other vias: 41.66,20.07 54.1,21.34 34.16,15.62 27.3,14.61 20.19,15.62 13.34,14.61 86.87,15.24 100.97,14.22 94.36,21.08 63.63,16.26 78.36,16.26 75.56,35.56 102.87,24.13 2.54,26.67 2.29,21.21 30.48,39.37 86.61,24.13 55.88,25.02 59.31,32 65.15,32 28.96,7.62 34.54,7.62 4.7,27.3 16.89,34.29 86.49,26.42 82.68,26.42 79.76,26.42 74.93,31.24 67.18,11.81 96.52,19.3
  pour Bottom (isolate 0.305): 0,0 105,0 105,41.5 0,41.5
  pour Top (isolate 0.305): 0,0 105,0 105,41.5 0,41.5
I_E_F1
  Top 0.305: IC5.7 R57.2
I_E_F2
  Top 0.305: IC5.1 R58.2
I_F1
  Top 0.305: Q5.4 Q5.5 30.48,23.37 28.45,25.4 27.09,25.4 R57.1
I_F2
  Top 0.305: Q6.4 Q6.5 16.51,24.13 15.24,25.4 11.43,25.4 R58.1
IN  (via drill 0.4)
  Top 0.305: C3.1 31.02,15.56 R7.2 31.11,14.99 31.75,14.35 34.8,14.35 36.96,16.51 | R20.1 v95.25,9.4 | v91.69,9.4 61.72,9.4 60.96,10.16 v45.72,10.16 | R40.2 43.79,16.8 IC1.7 | 36.96,16.51 43.18,16.51 R40.2 | R35.1 36.28,17.18 36.96,16.51 | R40.2 45.3,16.8 TP2.TP
  Bottom 0.305: v95.25,9.4 v91.69,9.4 | v45.72,10.16 45.21,10.67 45.21,16.13 TP2.TP
JFET_D
  Top 0.305: R56.2 38.44,17.95 | 38.44,17.95 Q12.1 | R47.2 37.85,18.54 38.44,17.95
JFET_G
  Top 0.305: Q12.3 40.13,20.54 R47.1 37.88,20.57 R48.2
JFET_S
  Top 0.305: IC1.6 43.7,19.02 R40.1 42.02,18.5 Q12.2
LIN_FM
  Top 0.305: X1.2 40.64,37.07 40.64,38.37 39.42,39.59 R52.1 33.45,39.59 R15.1
N$1
  Top 1.016: D2.C 97.28,32.39 99.06,34.16 SV1.2
  Bottom 1.016: SV1.1 SV1.2
N$2
  Top 0.406: R19.2 6.35,4.05 SW1.1
N$3
  Top 0.305: IC6.2 96.17,22.54 96.63,22.08 | 96.63,22.08 R61.2 | R62.1 95.08,20.54 96.63,22.08
N$4
  Top 0.305: R43.1 RV6.1
N$6
  Top 0.305: Q11.1 4.46,22.82 D3.C | D3.C 4.7,24.26 7.53,27.09 R45.2 | D3.C 2.76,23.06 R13.1
N$8
  Top 0.305: Q11.3 4.49,18.75 D4.C 7.91,18.75 R14.1
N$9
  Top 0.305: R54.1 6.35,23.71 D4.A
N$10
  Top 0.305: R46.1 86.32,6.77 85.34,7.75 77.6,7.75 73.15,3.3 RV3.2
N$11
  Top 0.305: IC2.5 67.04,15.86 66.93,15.75 66.93,14.44 R39.2 64.98,13.55 64.14,12.7 C21.2
N$12
  Top 0.305: IC1.2 44.29,21.62 43.56,22.35 R49.1 42.08,23.03 C1.2 39.5,22.48 38.73,23.24 38.73,25.09 40.18,26.54 D5.C
N$13
  Top 0.305: R19.1 R18.1 R17.1 17.78,11.01 18.33,11.56 23.62,11.56 24.13,12.06 39.16,12.06 R50.1 R12.1 | R12.1 43.94,12.28 R43.2 44.36,13.63 44.58,13.84 48.51,13.84 49.51,14.84 49.51,18.51 50.02,19.02 IC1.9 | R12.1 41.91,15.15 R11.1
N$14
  Top 0.406: R18.2 8.89,4.09 SW1.2
N$15
  Top 1.016: D1.A 76.07,40.26 88.01,40.26 88.9,39.37 SV1.9
  Bottom 1.016: SV1.9 SV1.10
N$16
  Top 0.406: R17.2 11.43,4.13 SW1.3
N$17
  Top 0.305: R46.2 R44.2 95.25,11.01 95.25,13.46 95.73,13.94 IC4.9 98.67,13.94 R16.1
N$19
  Top 0.305: IC4.6 89.29,13.94 89.11,13.76 | 89.11,13.76 R24.1 | R25.2 87.2,13.76 89.11,13.76
N$20
  Top 0.305: IC4.13 98.03,16.54 99.06,17.57 R38.1 100.16,18.2 102.23,16.13 102.23,10.79 101.6,10.16 101,10.16 R37.2 100.16,9.4 R20.2
N$21
  Top 0.305: IC4.5 93.33,14.59 93.6,14.86 93.6,16.26 93.31,16.54 IC4.2 90.14,16.54 89.41,17.27 88.14,17.27 87.33,18.09 | 87.33,18.09 D7.C | R26.2 85.09,15.85 87.33,18.09
N$23
  Top 0.305: IC3.13 78.5,29.24 R33.1 R34.2
N$26
  Top 0.305: RV5.1 42.32,27.34 R42.2
N$30  (via drill 0.4)
  Top 0.305: R21.1 R22.1 79.59,16.6 v79.5,16.51 | v69.85,14.61 69.81,14.56 IC2.7 IC2.6
  Bottom 0.305: v79.5,16.51 79.37,16.51 78.36,17.52 72.76,17.52 v69.85,14.61
N$31
  Top 0.305: IC2.13 75.81,17.81 R23.1 76.92,18.92 77.22,18.92 77.89,19.6 R21.2
N$32
  Top 0.305: R22.2 77.27,17.16 IC2.12 73.01,17.16 70.61,19.56 67.44,19.56 65.41,21.59 IC8.7
N$33
  Top 0.305: D7.A 91.08,18.45 IC4.1
N$34
  Top 0.305: IC2.2 65.16,17.81 R30.1 64.77,18.41 R31.2
N$35
  Top 0.305: IC2.9 75.05,15.21 75.82,14.44 77.34,14.44 77.72,14.82 R28.1 80.26,14.82 R27.2 80.43,16.21 81.15,16.93 R29.2
N$36
  Top 0.305: RV2.2 52.2,5.08 51.44,5.84 45.21,5.84 41.91,9.14 R12.2
N$37
  Top 0.305: RV1.2 34.24,5.84 37.47,5.84 39.37,7.75 R50.2
N$38
  Top 0.305: R60.1 23.81,34.29 25.08,33.02 29,33.02 R59.2
N$39  (via drill 0.35, 0.4)
  Top 0.305: R30.2 65.51,19.9 66.95,18.46 IC2.1 69.81,18.46 v69.85,18.41 | R29.1 81.15,20.45 80.39,21.21 73.66,21.21 v73.15,20.7
  Bottom 0.305: v73.15,20.7 70.87,18.41 v69.85,18.41
N$40
  Top 0.305: IC2.3 63.09,17.16 R32.2 61.59,17.36 61.59,19.68 59.05,22.23 IC8.2
N$45
  Top 0.305: IC5.3 16.51,32.51 | 16.51,32.51 20.83,32.51 21.59,31.75 IC5.5 | R55.1 30.77,36.32 25.78,36.32 25.4,36.7 25.4,39.37 24.77,40.01 22.73,40.01 21.59,38.86 IC5.10 21.59,37.21 20.45,36.07 17.02,36.07 16,35.05 16,33.02 16.51,32.51
N$46
  Top 0.305: IC5.8 26.89,37.88 R52.2 34.92,36.2 36.07,35.05 41.78,35.05 44.45,32.38 48.03,32.38 51.56,28.86 51.56,23.75 52.45,22.86 52.45,21.84 52.23,21.62 IC1.13 51.13,21.59 48.9,21.59 48.77,21.46 48.77,15.75 47.88,14.86 43.9,14.86 R51.2
N$48
  Top 0.305: IC1.14 50.8,22.63 50.8,28.57 47.62,31.75 43.18,31.75 40.64,34.29 35.56,34.29 33.66,36.2 R55.2
N$53
  Top 0.305: D6.A D5.A 36.83,27.1 36.83,19.65 R35.2
N$54
  Top 0.305: R44.1 93.2,6.28 RV4.2
N$57
  Top 0.305: IC1.1 45.36,23.22 43.85,24.73 R49.2 43.01,25.28 C1.1 40.73,25.28 R48.1
N$59
  Top 0.305: Q5.2 30.48,20.07 31.24,19.3 32.26,19.3 33.02,18.54 R1.1
N$64
  Top 0.305: Q3.3 30.1,21.59 29.73,21.96 Q5.6 28.71,23.51 | Q7.1 24.91,24.55 27.67,24.55 28.71,23.51 | C3.2 28.71,17.96 28.71,23.51
N$67  (via drill 0.4)
  Top 0.305: Q5.1 29.73,19.67 30.61,18.8 | R7.1 31.11,18.29 30.61,18.8 | R8.2 R2.1 27.3,18.41 v27.69,18.8 | v29.72,18.8 30.61,18.8
  Bottom 0.305: v27.69,18.8 v29.72,18.8
N$68
  Top 0.305: D6.C 40.98,29.04 R42.1
N$70
  Top 0.305: Q8.1 Q7.2
N$73
  Top 0.305: IC3.6 IC3.7
N$74
  Top 0.305: IC3.9 IC3.8
N$77
  Top 0.305: Q5.3 35.44,20.69 Q3.1 35.93,20.94 36.2,21.21 36.2,24.77 35.56,25.4 33.91,25.4 33.54,25.77 Q1.6
N$78
  Top 0.305: Q3.2 35.04,22.39 Q1.3 Q1.2 Q1.1
N$79
  Top 0.305: Q6.2 16.51,19.94 17.14,19.3 18.16,19.3 19.05,18.41 R3.1
N$83  (via drill 0.4)
  Top 0.305: Q6.1 15.76,19.55 16.51,18.8 | R9.1 17.14,18.16 16.51,18.8 | R10.2 R4.1 13.34,18.41 v13.72,18.8 | v15.75,18.8 16.51,18.8
  Bottom 0.305: v13.72,18.8 v15.75,18.8
N$84
  Top 0.305: Q10.1 Q9.2
N$85
  Top 0.305: Q6.3 21.22,20.69 Q4.1 21.96,20.94 22.23,21.21 22.23,24.89 21.72,25.4 19.94,25.4 19.57,25.77 Q2.6
N$86
  Top 0.305: Q2.1 Q2.2 Q2.3 21.07,22.39 Q4.2
OUT_1  (via drill 0.4)
  Top 0.305: Q8.2 22.86,18.66 22.86,17.78 | 22.86,17.78 R5.1 22.44,17.36 21.08,16 21.08,14.99 20.7,14.61 17.78,14.61 17.14,15.24 R9.2 17.05,15.56 C2.1 | 22.86,17.78 24.98,15.66 R8.1 25.31,15.66 v24.38,14.73 | v24.89,10.92 25.4,11.43 58.97,11.43 60.11,12.57 60.27,12.57 61.51,12.7 C21.1
  Bottom 0.305: v24.89,10.92 24.64,11.18 24.64,14.48 v24.38,14.73
OUT_2
  Top 0.305: Q10.2 10.53,18.53 9.36,17.36 R6.1 9.31,17.36 11.01,15.66 R10.1 11.43,13.97 11.81,13.59 36.45,13.59 37.85,14.99 R56.1
SAW  (via drill 0.4)
  Top 0.305: R23.2 75.46,19.9 IC2.14 74,18.46 70.48,21.97 v68.96,21.97 | X1.12 65.97,34.33 68.83,31.47 v68.83,25.25
  Bottom 0.305: v68.96,21.97 69.09,22.1 69.09,24.99 v68.83,25.25
SHAPE  (via drill 0.4)
  Top 0.305: 97,13.18 98.32,11.85 R16.2 99.11,11.9 R37.1 | 97,13.18 IC4.8 | R26.1 R25.1 87,11.56 87.76,10.79 90.81,10.79 92.2,12.19 v92.96,12.19 | v96.14,12.19 97,13.05 97,13.18
  Bottom 0.305: v92.96,12.19 v96.14,12.19
SHAPE_IN  (via drill 0.4)
  Top 0.305: RV4.3 98.2,4.67 95.25,7.62 86.74,7.62 85.85,8.51 58.93,8.51 v58.42,9.02 | v58.42,12.7 58.42,20.32 54.61,24.13 54.61,34.54 55.24,35.18 56.39,35.18 58.21,37 X1.9
  Bottom 0.305: v58.42,9.02 v58.42,12.7
TRI  (via drill 0.4)
  Top 0.305: IC2.8 75.46,13.12 R28.2 80.43,13.12 81.28,13.97 81.28,16 82.55,17.27 82.55,21.59 81.28,22.86 v68.2,22.86 | X1.11 64.32,36.11 64.32,34.84 67.94,31.21 v67.94,27.81
  Bottom 0.305: v67.94,27.81 67.94,23.11 v68.2,22.86
XMOD
  Top 0.305: 14.81,23.44 14.62,23.63 13.7,24.55 10.94,24.55 Q9.1 10.52,24.13 R54.2 | 14.81,23.44 Q6.6 15.76,21.96 16.13,21.59 Q4.3 | C2.2 14.81,17.89 14.81,23.44
XMOD_IN
  Top 0.305: R45.1 7.62,38.1 10.16,40.64 43.18,40.64 45.65,38.17 X1.4

### Text on the board
tPlace: lorelei B v1.1 | (c) 2021 expert sleepers | Amplitude | -12V | V/oct trim